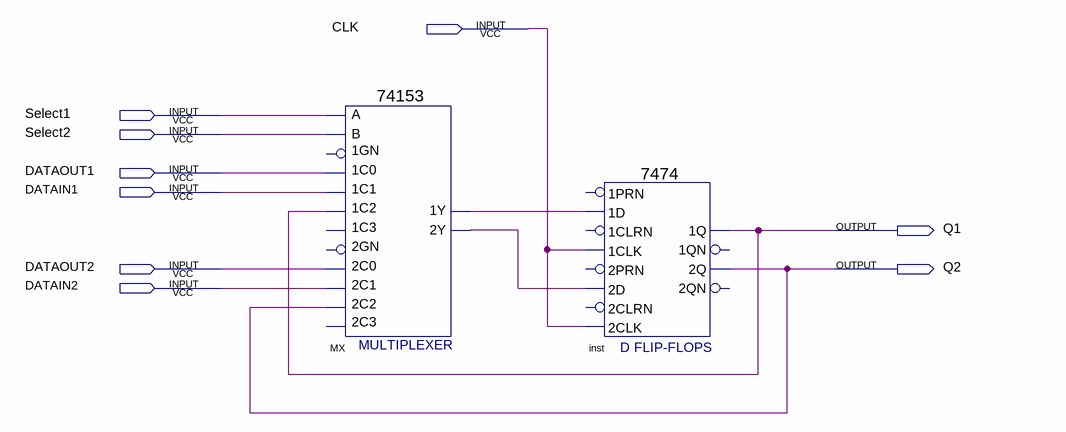
[diagram p0: schematic sheet]
// Quartus schematic Block3.bdf as structural Verilog: 2 symbols, 9 pins
module Block3 (
  input  CLK,
  input  Select1,
  input  Select2,
  input  DATAOUT1,
  input  DATAIN1,
  input  DATAOUT2,
  input  DATAIN2,
  output Q1,
  output Q2
);

  wire MX_1y, MX_2y;

  \74153  MX (
    .\1C1 (DATAIN1), .\1C0 (DATAOUT1), .\2C0 (DATAOUT2), .\2C2 (Q2), .\1C2 (Q1), .B(Select2), .A(Select1),
    .\2C1 (DATAIN2), .\1Y (MX_1y), .\2Y (MX_2y));  // open: 1GN, 2GN, 1C3, 2C3
  \7474  inst (
    .\2D (MX_2y), .\1CLK (CLK), .\1D (MX_1y), .\2CLK (CLK), .\2Q (Q2), .\1Q (Q1));  // open: 2PRN, 1PRN, 2CLRN, 1CLRN, 1QN, 2QN
endmodule
